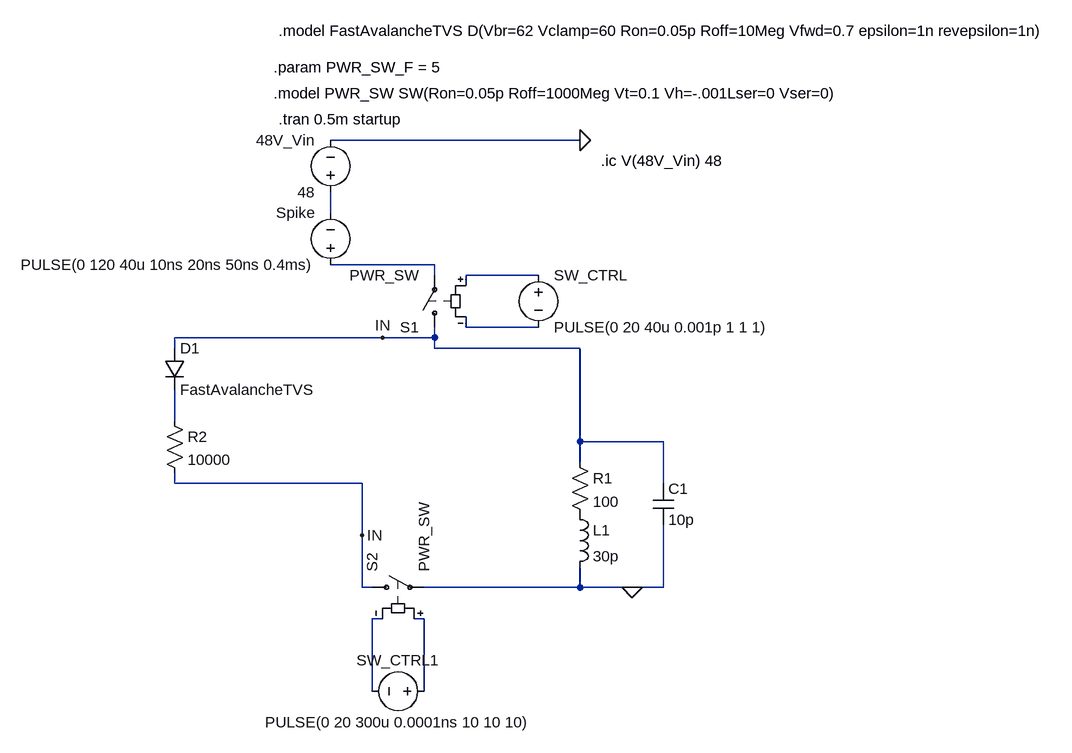
[diagram p0: schematic Draft1.asc]
Draft1.asc, the LTspice schematic file:
Version 4
SHEET 1 1376 680
WIRE 288 -272 -96 -272
WIRE -96 -160 -96 -192
WIRE 64 -80 -96 -80
WIRE 64 -64 64 -80
WIRE 224 -64 112 -64
WIRE 112 -48 112 -64
WIRE 112 16 112 0
WIRE 224 16 112 16
WIRE -16 32 -336 32
WIRE 64 32 64 16
WIRE 64 32 -16 32
WIRE -336 48 -336 32
WIRE 64 48 64 32
WIRE 288 48 64 48
WIRE -336 160 -336 112
WIRE 288 192 288 48
WIRE 416 192 288 192
WIRE 288 224 288 192
WIRE -336 256 -336 240
WIRE -48 256 -336 256
WIRE 416 256 416 192
WIRE -48 336 -48 256
WIRE -48 416 -48 336
WIRE -32 416 -48 416
WIRE 288 416 288 384
WIRE 288 416 48 416
WIRE 368 416 288 416
WIRE 416 416 416 320
WIRE 416 416 368 416
WIRE -16 464 -32 464
WIRE 48 464 32 464
WIRE -32 576 -32 464
WIRE 48 576 48 464
FLAG 288 -272 0
FLAG -16 32 IN
FLAG 368 416 0
FLAG -48 336 IN
SYMBOL voltage -96 -176 R180
WINDOW 0 24 96 Left 2
WINDOW 3 24 16 Left 2
SYMATTR InstName 48V_Vin
SYMATTR Value 48
SYMATTR SpiceLine Rser=0.01
SYMBOL diode -352 48 R0
SYMATTR InstName D1
SYMATTR Value FastAvalancheTVS
SYMBOL voltage -96 -64 R180
WINDOW 0 24 96 Left 2
WINDOW 3 24 16 Left 2
SYMATTR InstName Spike
SYMATTR Value PULSE(0 120 40u 10ns 20ns 50ns 0.4ms)
SYMBOL sw 64 32 R180
SYMATTR InstName S1
SYMATTR Value PWR_SW
SYMBOL voltage 224 -80 R0
SYMATTR InstName SW_CTRL
SYMATTR Value PULSE(0 20 40u 0.001p 1 1 1)
SYMBOL Res 272 208 R0
SYMATTR InstName R1
SYMATTR Value 100
SYMBOL Ind 272 288 R0
SYMATTR InstName L1
SYMATTR Value 30p
SYMBOL Cap 400 256 R0
SYMATTR InstName C1
SYMATTR Value 10p
SYMBOL sw -48 416 R270
SYMATTR InstName S2
SYMATTR Value PWR_SW
SYMBOL voltage 64 576 R90
WINDOW 0 -32 56 VBottom 2
WINDOW 3 32 56 VTop 2
SYMATTR InstName SW_CTRL1
SYMATTR Value PULSE(0 20 300u 0.0001ns 10 10 10)
SYMBOL Res -352 144 R0
SYMATTR InstName R2
SYMATTR Value 10000
TEXT -176 -304 Left 2 !.tran 0.5m startup
TEXT -184 -344 Left 2 !.model PWR_SW SW(Ron=0.05p Roff=1000Meg Vt=0.1 Vh=-.001Lser=0 Vser=0)
TEXT -184 -384 Left 2 !.param PWR_SW_F = 5
TEXT -176 -440 Left 2 !.model FastAvalancheTVS D(Vbr=62 Vclamp=60 Ron=0.05p Roff=10Meg Vfwd=0.7 epsilon=1n revepsilon=1n)
TEXT 320 -240 Left 2 !.ic V(48V_Vin) 48

The netlist it stands for:
* Draft1.asc
V§48V_Vin N001 0 48 Rser=0.01
D1 IN N005 FastAvalancheTVS
V§Spike N002 N001 PULSE(0 120 40u 10ns 20ns 50ns 0.4ms)
S1 IN N002 N003 N004 PWR_SW
V§SW_CTRL N003 N004 PULSE(0 20 40u 0.001p 1 1 1)
R1 IN P001 100
L1 P001 0 30p
C1 IN 0 10p
S2 IN 0 N007 N006 PWR_SW
V§SW_CTRL1 N007 N006 PULSE(0 20 300u 0.0001ns 10 10 10)
R2 N005 IN 10000
.model D D
.lib standard.dio
.tran 0.5m startup
.model PWR_SW SW(Ron=0.05p Roff=1000Meg Vt=0.1 Vh=-.001Lser=0 Vser=0)
.param PWR_SW_F = 5
.model FastAvalancheTVS D(Vbr=62 Vclamp=60 Ron=0.05p Roff=10Meg Vfwd=0.7 epsilon=1n revepsilon=1n)
.ic V(48V_Vin) 48
.backanno
.end